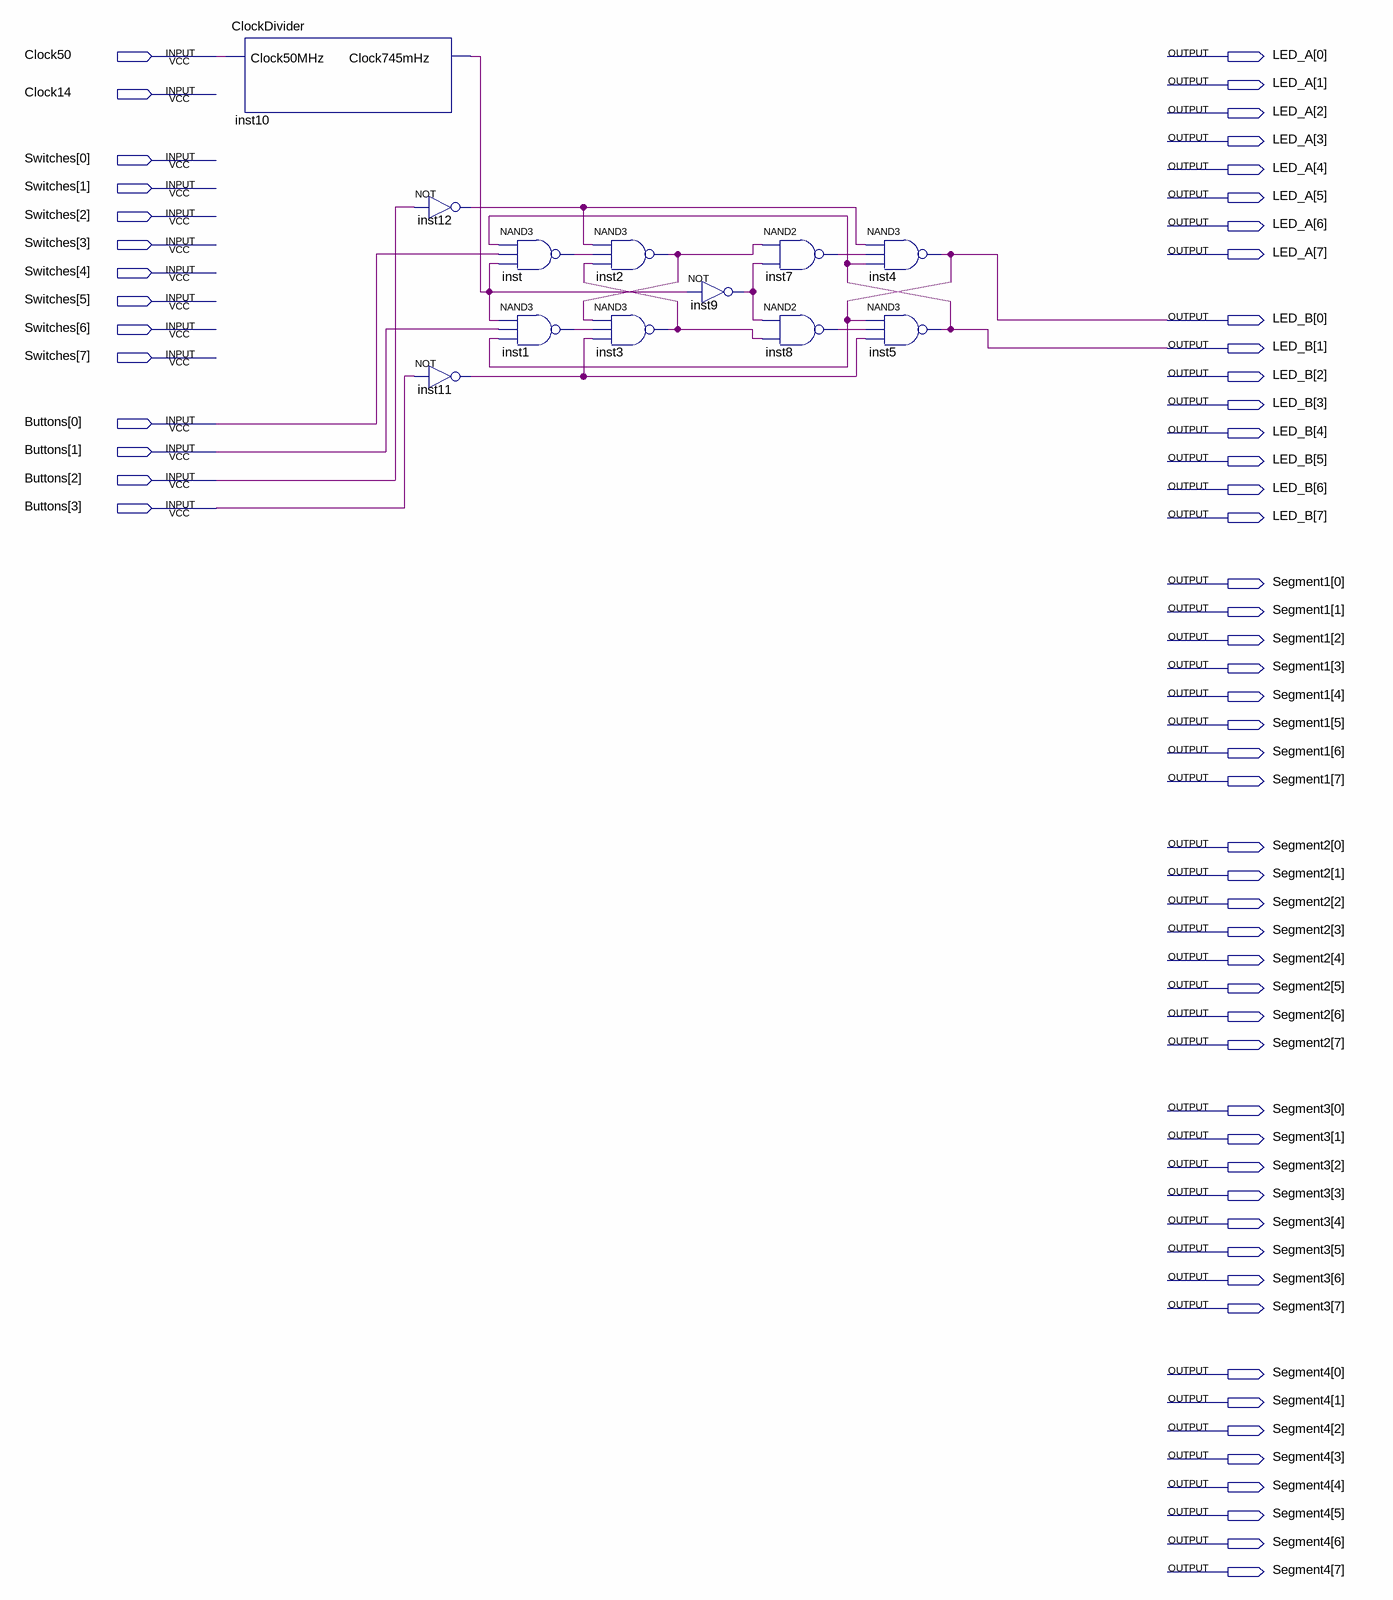
[diagram p0: schematic sheet]
// Quartus schematic JKMSFlipFlop.bdf as structural Verilog: 12 symbols, 62 pins
module JKMSFlipFlop (
  input  Clock50,
  input  Clock14,
  input  [7:0] Switches,
  input  [3:0] Buttons,
  output [7:0] LED_A,
  output [7:0] LED_B,
  output [7:0] Segment1,
  output [7:0] Segment2,
  output [7:0] Segment3,
  output [7:0] Segment4
);

  wire inst1_out, inst2_out, inst3_out, inst7_out, inst8_out, inst9_out, inst10_clock745mhz, inst11_out,
       inst12_out, inst_out;

  ClockDivider inst10 (.Clock50MHz(Clock50), .Clock745mHz(inst10_clock745mhz));
  not inst12 (inst12_out, Buttons[2]);
  not inst11 (inst11_out, Buttons[3]);
  nand inst (inst_out, LED_B[1], Buttons[0], inst10_clock745mhz);
  nand inst1 (inst1_out, inst10_clock745mhz, Buttons[1], LED_B[0]);
  nand inst2 (inst2_out, inst12_out, inst_out, inst3_out);
  nand inst3 (inst3_out, inst2_out, inst1_out, inst11_out);
  not inst9 (inst9_out, inst10_clock745mhz);
  nand inst7 (inst7_out, inst2_out, inst9_out);
  nand inst8 (inst8_out, inst9_out, inst3_out);
  nand inst4 (LED_B[0], inst12_out, inst7_out, LED_B[1]);
  nand inst5 (LED_B[1], LED_B[0], inst8_out, inst11_out);
endmodule
